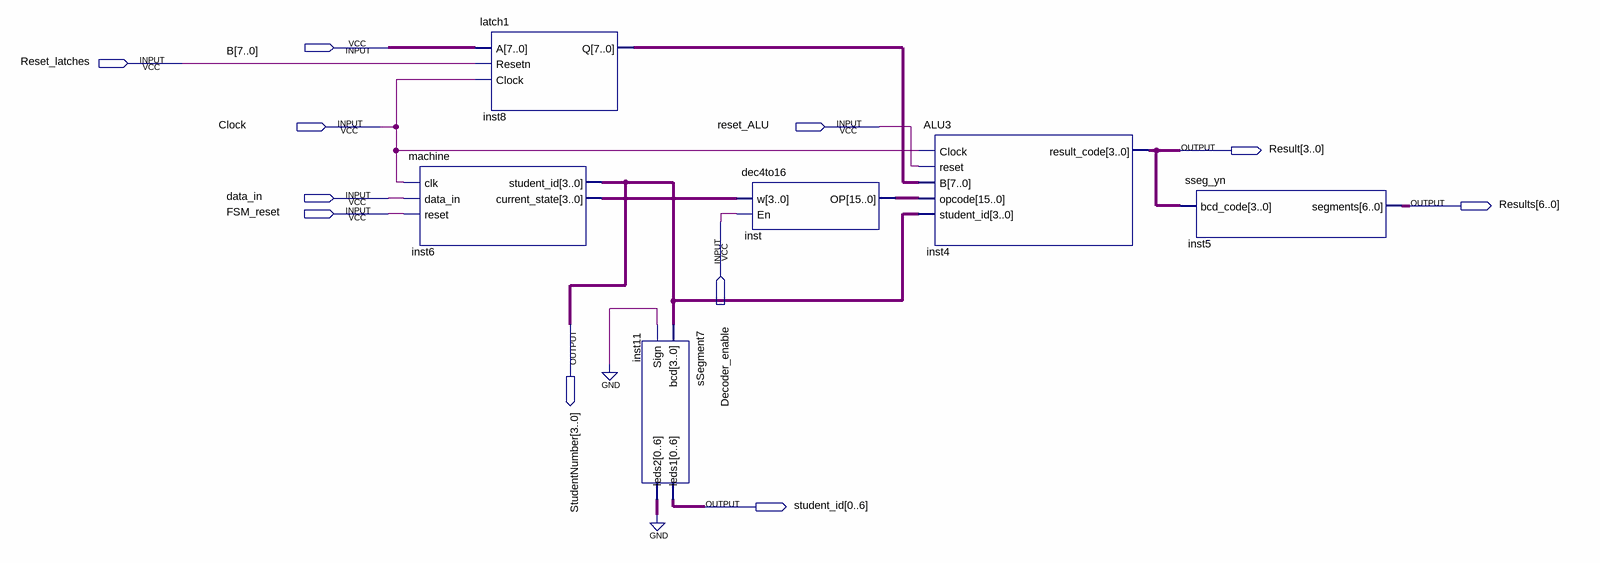
[diagram p0: schematic sheet]
// Quartus schematic problem3.bdf as structural Verilog: 6 symbols, 11 pins
module problem3 (
  input  [7:0] B,
  input  Reset_latches,
  input  Clock,
  input  reset_ALU,
  input  data_in,
  input  FSM_reset,
  input  Decoder_enable,
  output [3:0] Result,
  output [6:0] Results,
  output [3:0] StudentNumber,
  output [0:6] student_id
);

  wire [3:0] inst6_current_state;
  wire [6:0] inst11_leds2;
  wire [7:0] inst8_q;
  wire [15:0] inst_op;

  machine inst6 (
    .clk(Clock), .data_in(data_in), .reset(FSM_reset), .student_id(StudentNumber),
    .current_state(inst6_current_state));
  latch1 inst8 (.A(B), .Resetn(Reset_latches), .Clock(Clock), .Q(inst8_q));
  sSegment7 inst11 (.bcd(StudentNumber), .Sign(1'b0), .leds1(student_id), .leds2(inst11_leds2));
  dec4to16 inst (.w(inst6_current_state), .En(Decoder_enable), .OP(inst_op));
  ALU3 inst4 (
    .Clock(Clock), .reset(reset_ALU), .B(inst8_q), .opcode(inst_op), .student_id(StudentNumber),
    .result_code(Result));
  sseg_yn inst5 (.bcd_code(Result), .segments(Results));
  // also tied to GND on the sheet: {inst11_leds2[0], inst11_leds2[1], inst11_leds2[2], inst11_leds2[3], inst11_leds2[4], inst11_leds2[5], inst11_leds2[6]}
endmodule
